# EAGLE design timer5 (EAGLE 5.07)
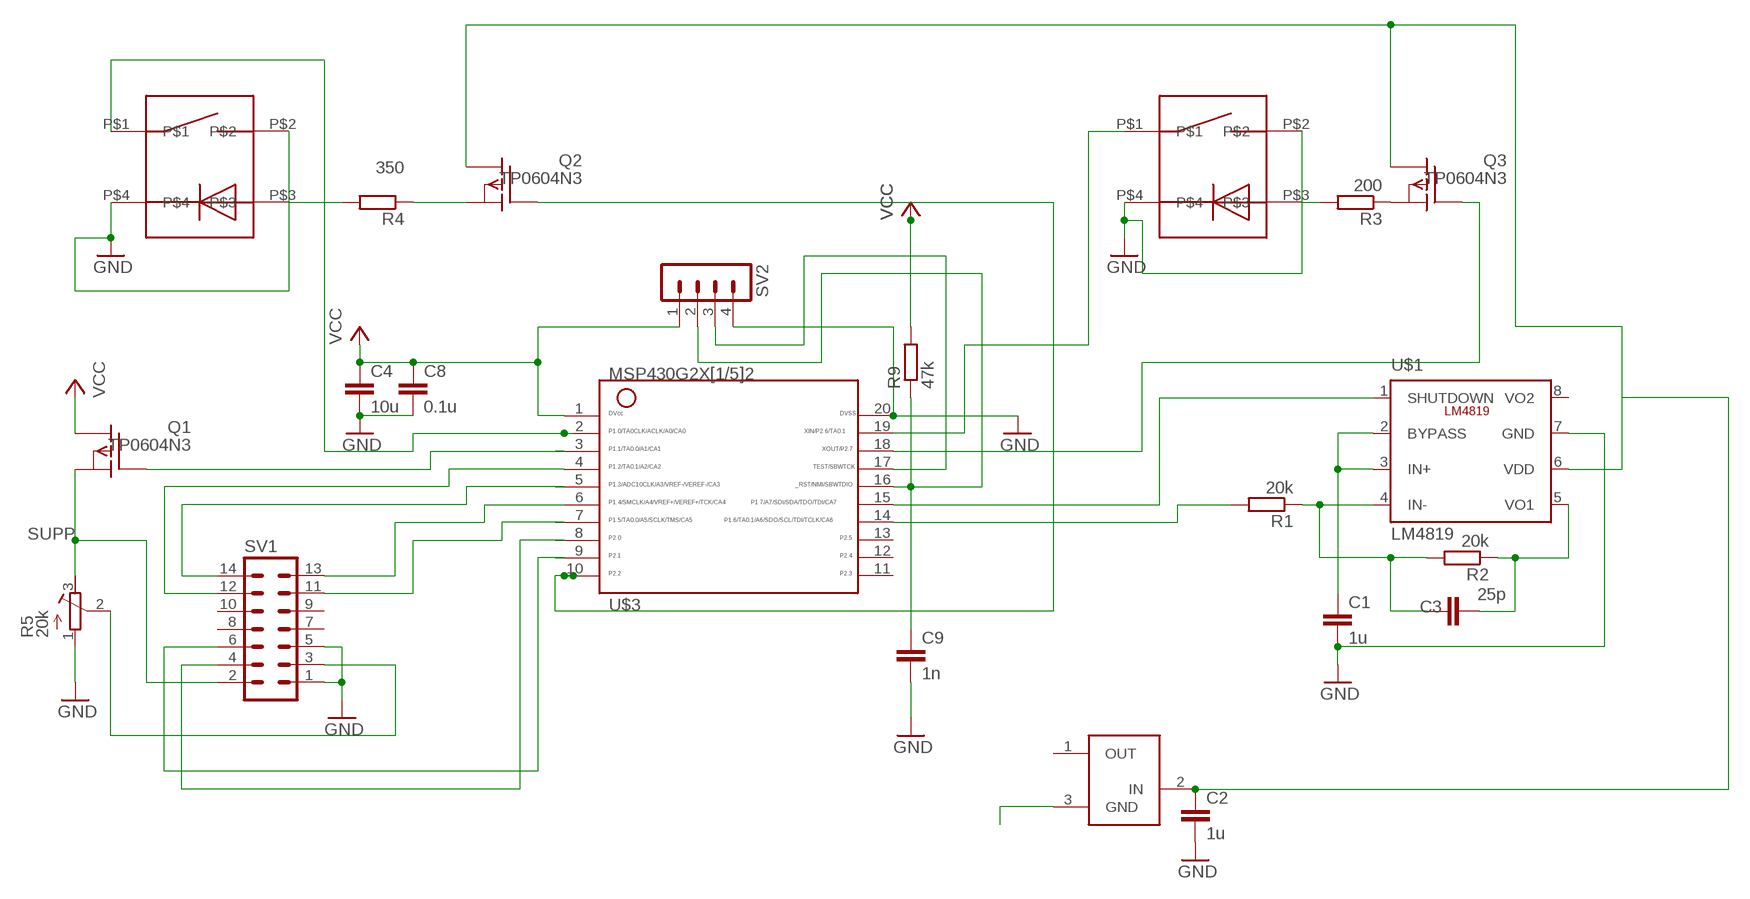
[diagram p0: schematic, sheet 1]

## Parts
C1  1u  C-EU025-025X050  [C025-025X050]
C2  1u  C-EU025-025X050  [C025-025X050]
C3  25p  C-EU075-032X103  [C075-032X103]
C4  10u  C-EUC0603  [C0603]
C8  0.1u  C-EU025-025X050  [C025-025X050]
C9  1n  C-EU150-054X183  [C150-054X183]
Q1  TP0604N3  [TO-92]
Q2  TP0604N3  [TO-92]
Q3  TP0604N3  [TO-92]
R1  20k  R-EU_0204/5  [0204/5]
R2  20k  R-EU_0204/7  [0204/7]
R3  200  R-EU_0204/5  [0204/5]
R4  350  R-EU_0204/5  [0204/5]
R5  20k  R-TRIMM3339P  [RTRIM3339P]
R9  47k  R-EU_0207/10  [0207/10]
SV1  MA07-2  [MA07-2]
SV2  MA04-1  [MA04-1]
U$1  LM4819  [SO08]
U$2  MCP1700-3002E  [TO92]
U$3  G2X[1/5]2---N20  [N20]
U$4  BOUTTONAVECLED  [BOUTTONAVECLED]
U$5  BOUTTONAVECLED  [BOUTTONAVECLED]

## Nets
GND: C1.2 C2.2 C4.2 C8.2 C9.2 R5.1(E) SV1.1 SV1.5 SV2.4 U$1.7(GND) U$3.20 U$4.P$2 U$4.P$4 U$5.P$2 U$5.P$4
N$1: Q1.2(G) U$3.3
N$2: SV2.3 U$3.17
N$3: SV1.12 U$3.4
N$4: SV1.14 U$3.5
N$5: SV1.11 U$3.7
N$6: SV1.13 U$3.6
N$9: C3.2 R2.1 U$1.5(VO1)
N$10: SV1.4 U$3.8
N$11: SV1.6 U$3.9
N$12: Q3.1(S) R3.1
N$13: C9.1 R9.1 SV2.2 U$3.16
N$14: C1.1 U$1.2(BYPASS) U$1.3(IN+)
N$15: U$1.1(SHUTDOWN) U$3.15
N$16: R1.2 U$3.14
N$17: R5.2(S) SV1.3
N$18: C3.1 R1.1 R2.2 U$1.4(IN-)
N$24: U$2.3(GND)
N$28: U$3.2 U$4.P$1
N$29: Q3.2(G) U$3.18
N$30: R4.2 U$4.P$3
N$32: Q2.1(S) R4.1
N$33: U$3.19 U$5.P$1
N$34: Q2.2(G) U$3.10
N$35: R3.2 U$5.P$3
N$36: C2.1 Q2.3(D) Q3.3(D) U$1.6(VDD) U$2.2(IN)
SUPP: Q1.1(S) R5.3(A) SV1.2
VCC: C4.1 C8.1 Q1.3(D) R9.2 SV2.1 U$3.1
Unconnected: SV1.7 SV1.8 SV1.9 SV1.10 U$1.8(VO2) U$2.1(OUT) U$3.11 U$3.12 U$3.13

## Library data of the parts
C1-C4 C8 C9 = resistor:C-EU: CAPACITOR, European symbol
Q1-Q3 = transistor-fet:TP0604N3: P-Channel Enhancement MOSFET -40V; -2A; 2,0Ohm
R1-R4 R9 = resistor:R-EU_: RESISTOR, European symbol
R5 = resistor:R-TRIMM: Trimm resistor
SV1 = con-lstb:MA07-2: PIN HEADER
SV2 = con-lstb:MA04-1: PIN HEADER
U$1 = mbonnin:LM4819: audio amplifier with shutdown
U$2 = mbonnin:MCP1700-3002E
U$3 = TI_MSP430_v16:G2X[1/5]2---N20: MSP430G2X[1/5]2 MSP430G2x52, MSP430G2x12 PDIP (N) 20 Pin Package http://focus.ti.com/docs/prod/folders/print/msp430g2452.html
U$4 U$5 = mbonnin:BOUTTONAVECLED

## Board
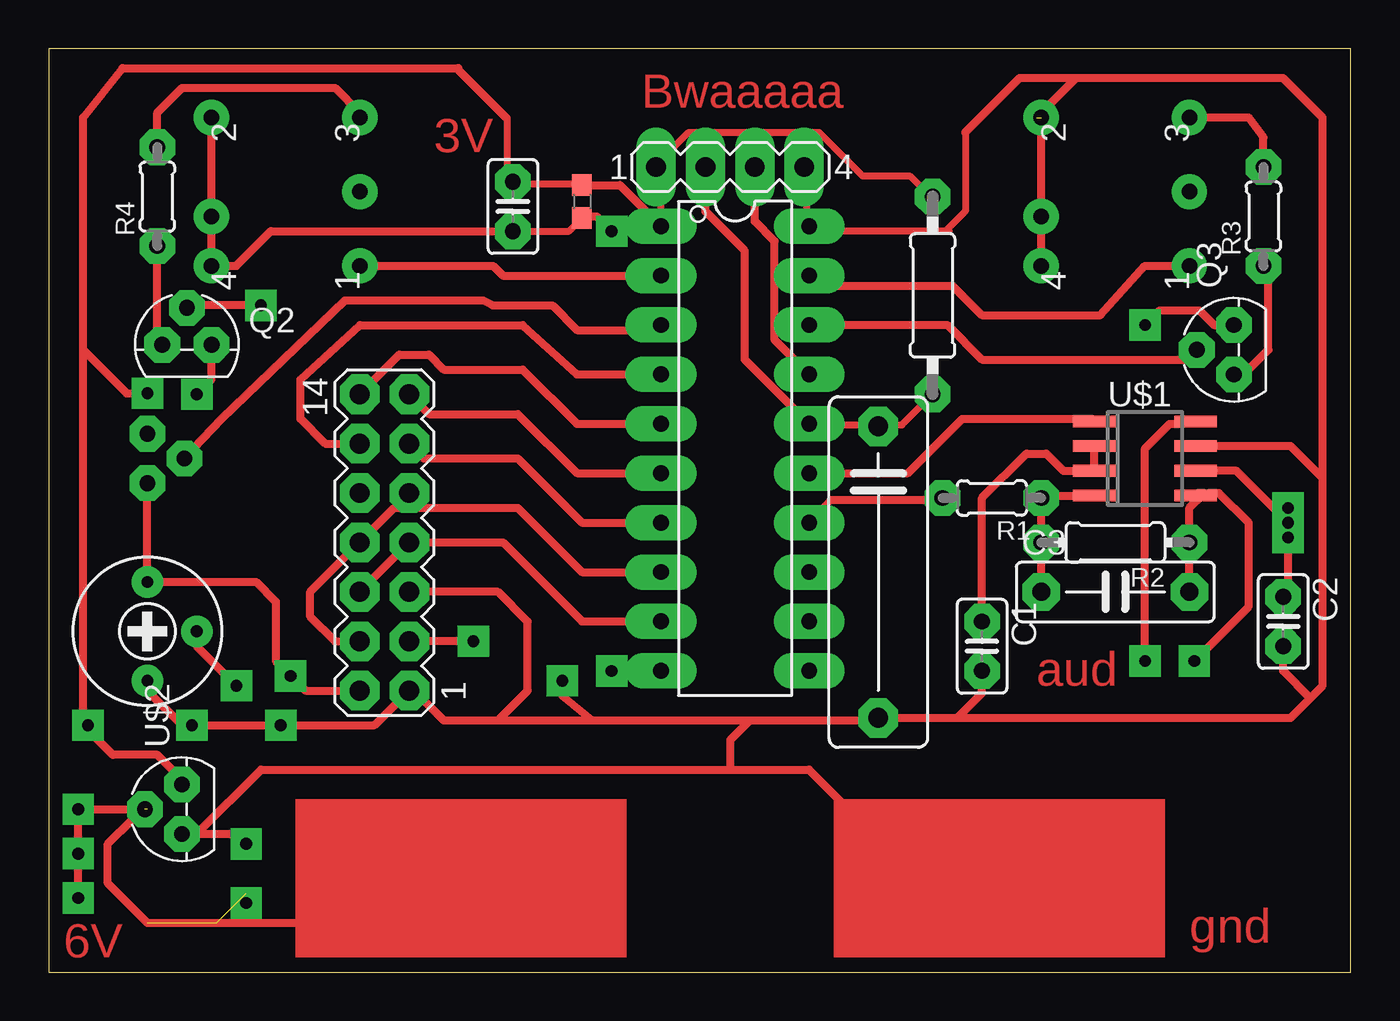
[diagram p1: board, top side]
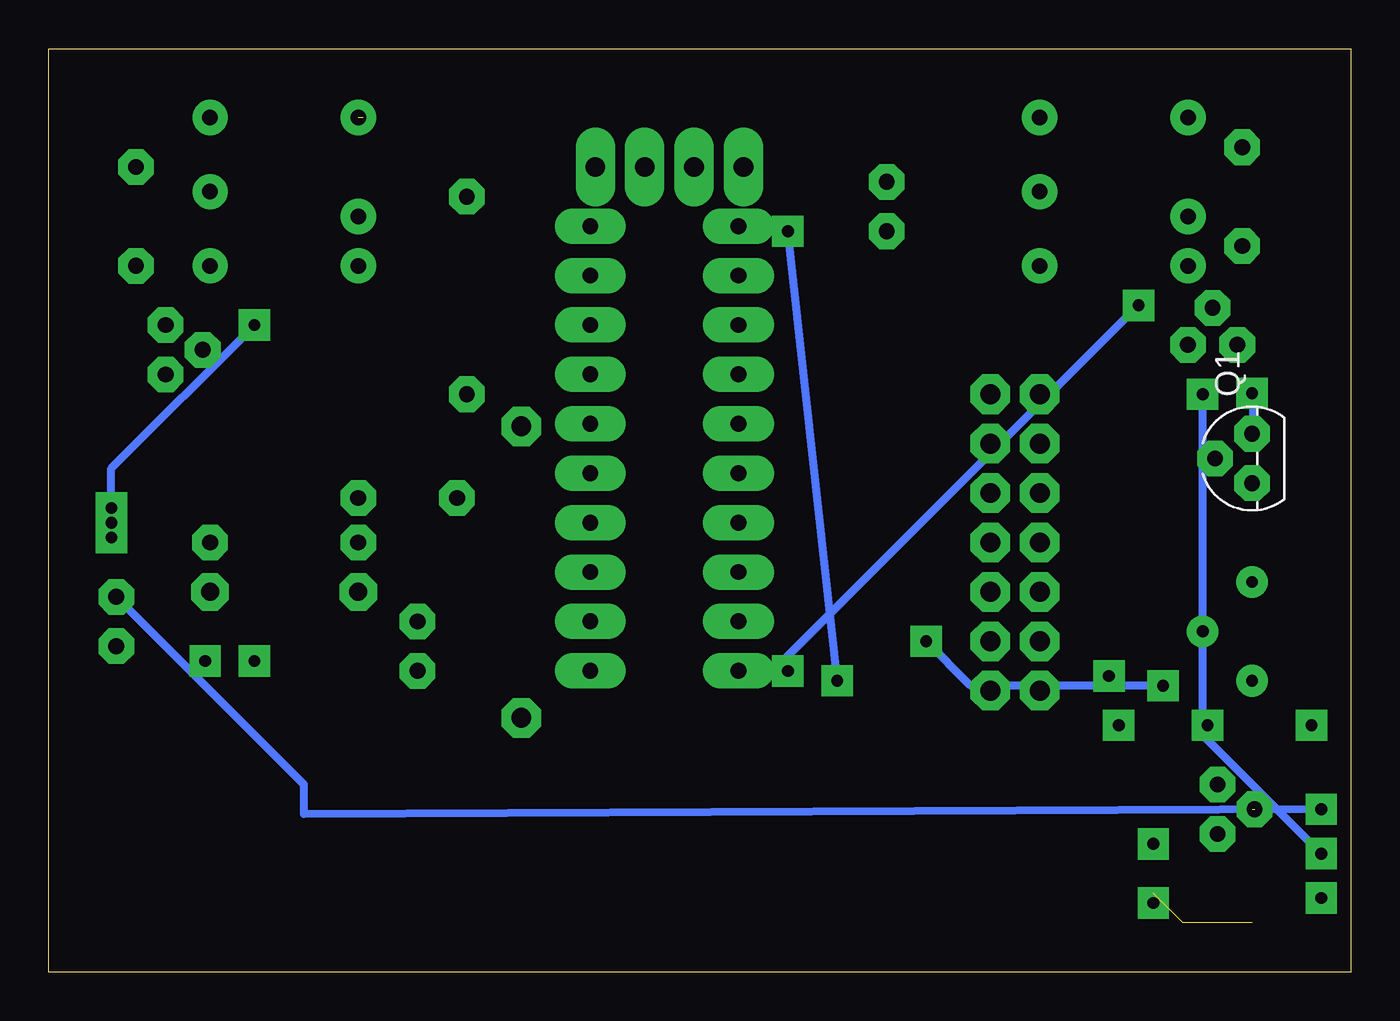
[diagram p2: board, bottom side, seen from below]

Size 66.98 x 47.49 mm. Coordinates in mm from the lower left corner, seen from the top.
Outline: 0,0 66.98,0 66.98,47.49 0,47.49 0,0
Copper layers (1*16): Top 0.035mm / dielectric 1.5mm / Bottom 0.035mm
Design rules "martin *": minimum track width 14mil, minimum drill 16mil, track to track 14mil, track to pad 20mil, pad to pad 8mil, via to via 8mil, smd to smd 8mil, copper to edge 8mil, drill to drill 8mil, minimum pad ring 20mil, minimum via ring 20mil, stop-mask expansion 4mil, vias tented up to drill 0mil, thermal gap 10mil

### Footprints (pad centres in the part's own frame; a part is rotated, then mirrored left to right if it is on the bottom)
C025-025X050 = drill 0.813 octagon: 1 -1.27,0; 2 1.27,0
C075-032X103 = drill 0.914 octagon: 1 -3.81,0; 2 3.81,0
C0603 = smd 1.1 x 1: 1 -0.85,0; 2 0.85,0
C150-054X183 = drill 1.016 octagon: 1 -7.493,0; 2 7.493,0
TO-92 = drill 0.813 octagon: 1 -1.27,0; 2 0,1.905; 3 1.27,0
0204/5 = drill 0.813 octagon: 1 -2.54,0; 2 2.54,0
0204/7 = drill 0.813 octagon: 1 -3.81,0; 2 3.81,0
RTRIM3339P = drill 0.61 round: 1 -2.54,0; 2 0,-2.54; 3 2.54,0
0207/10 = drill 0.813 octagon: 1 -5.08,0; 2 5.08,0
MA07-2 = drill 1.016 octagon: 1 -7.62,-1.27; 2 -7.62,1.27; 3 -5.08,-1.27; 4 -5.08,1.27; 5 -2.54,-1.27; 6 -2.54,1.27; 7 0,-1.27; 8 0,1.27; 9 2.54,-1.27; 10 2.54,1.27; 11 5.08,-1.27; 12 5.08,1.27; 13 7.62,-1.27; 14 7.62,1.27
MA04-1 = drill 1.016 long: 1 -3.81,0; 2 -1.27,0; 3 1.27,0; 4 3.81,0
SO08 = smd 0.6 x 2.2: 1 -1.905,-2.6; 2 -0.635,-2.6; 3 0.635,-2.6; 4 1.905,-2.6; 5 1.905,2.6; 6 0.635,2.6; 7 -0.635,2.6; 8 -1.905,2.6
TO92 = drill 0.813 octagon: 1 5.08,1.27; 2 3.81,3.175; 3 2.54,1.27
N20 = drill 0.813 long: 1 -11.435,-3.81; 2 -8.895,-3.81; 3 -6.355,-3.81; 4 -3.815,-3.81; 5 -1.275,-3.81; 6 1.265,-3.81; 7 3.805,-3.81; 8 6.345,-3.81; 9 8.885,-3.81; 10 11.425,-3.81; 11 11.425,3.81; 12 8.885,3.81; 13 6.345,3.81; 14 3.805,3.81; 15 1.265,3.81; 16 -1.275,3.81; 17 -3.815,3.81; 18 -6.355,3.81; 19 -8.895,3.81; 20 -11.435,3.81
BOUTTONAVECLED = drill 0.8 round: P$1 -3.81,-3.81; P$2 3.81,3.81; P$3 3.81,-3.81; P$4 -3.81,3.81; P$5 -1.27,3.81; P$6 0,-3.81

### Placement (x,y rotation side)
C1  48.01,16.76 270 top
C2  63.5,18.03 270 top
C3  54.86,19.56 0 top
C4  27.43,39.62 270 top
C8  23.88,39.37 270 top
C9  42.67,20.57 270 top
Q1  5.08,26.42 90 bottom
Q2  7.11,32.26 0 top
Q3  60.96,32 90 top
R1  48.51,24.38 180 top
R2  54.86,22.1 180 top
R3  62.48,38.86 90 top
R4  5.59,39.88 90 top
R5  5.08,17.53 90 top
R9  45.47,34.8 90 top
SV1  17.27,22.1 90 top
SV2  35.05,41.4 0 top
U$1  56.39,26.42 270 top
U$2  8.13,4.57 90 top
U$3  35.31,26.92 270 top
U$4  12.19,40.13 90 top
U$5  54.86,40.13 90 top

### Tracks (layer width: path | path; a pad name or v marks a point on that pad's centre or on a via)
GND  (via drill 0.6)  (1 unrouted)
  Top 0.356: SV2.4 39.01,41.35 39.01,38.51 U$3.20 39.22,38.3 39.42,38.1 46.13,38.1 46.23,38.2 | C4.2 27.38,38.71 26.77,38.1 C8.2 | 46.23,38.2 47.14,39.12 47.14,43.18 | 46.23,38.2 46.33,38.1 | C9.2 42.27,13.72
  Top 0.406: C4.2 27.6,38.77 27.69,38.86 28.19,38.86 v28.96,38.1 | R5.1 5.08,14.48 6.86,12.7 v7.37,12.7 v11.94,12.7 16.76,12.7 SV1.1 18.8,14.48 20.32,12.95 23.11,12.95 | 23.11,12.95 27.94,12.95 | 27.94,12.95 36.07,12.95 | 36.07,12.95 42.55,12.95 C9.2 46.74,13.08 | SV1.5 23.11,19.56 24.64,18.03 24.64,14.48 23.11,12.95 | 46.74,13.08 63.88,13.08 64.9,14.1 | 64.9,14.1 65.53,14.73 65.53,25.4 | 65.53,25.4 65.53,43.94 63.5,45.97 52.83,45.97 | 52.83,45.97 49.94,45.97 47.14,43.18 | v26.42,14.99 26.42,14.22 27.94,12.95 | C1.2 48.01,14.35 46.74,13.08 | U$1.7 63.88,27.05 65.53,25.4 | 35.05,10.67 35.05,11.94 36.07,12.95 | 52.83,45.97 50.8,43.94 | U$4.P$2 U$4.P$4 9.65,36.32 11.43,38.1 C8.2 | U$5.P$4 U$5.P$2 | C2.2 63.5,15.49 64.9,14.1
  Bottom 0.406: v26.42,14.99 v28.96,38.1
N$1
  Top 0.406: Q1.2 8.89,28.45 15.24,34.54 22.35,34.54 22.86,34.29 25.91,34.29 27.18,33.02 31.24,33.02 U$3.3
N$2
  Top 0.406: SV2.3 36.32,38.61 37.34,37.59 37.34,32.52 U$3.17
N$3
  Top 0.406: U$3.4 27.17,30.74 24.38,33.27 16,33.27 12.95,30.48 12.95,28.45 14.22,27.18 SV1.12
N$4
  Top 0.406: U$3.5 27.17,28.2 24.38,30.99 20.32,30.99 19.56,31.75 18.03,31.75 SV1.14
N$5
  Top 0.406: U$3.7 27.43,23.12 24.13,26.42 19.3,26.42 SV1.11
N$6
  Top 0.406: U$3.6 27.17,25.66 24.13,28.7 19.56,28.7 SV1.13
N$9
  Top 0.406: U$1.5 59.12,24.64 59.44,24.64 58.67,23.88 R2.1 C3.2
N$10
  Top 0.406: U$3.8 27.43,20.58 24.13,23.88 17.78,23.88 13.46,19.56 13.46,18.29 14.73,17.02 SV1.4
N$11
  Top 0.406: U$3.9 27.43,18.04 23.37,22.1 18.8,22.1 18.54,21.84 18.29,21.84 SV1.6
N$12
  Top 0.406: Q3.1 61.47,30.73 62.74,32 62.74,36.07 R3.1
N$13
  Top 0.356: 42.67,28.14 39.22,28.14 U$3.16 39.01,28.35 | 42.67,28.14 43.89,28.14 R9.1 | 42.67,28.14 C9.1
  Top 0.406: SV2.2 33.78,39.12 35.81,37.08 35.81,31.5 U$3.16
N$14
  Top 0.406: U$1.2 U$1.3 52.2,25.78 51.31,26.67 50.29,26.67 48.01,24.38 C1.1
N$15
  Top 0.406: U$3.15 44.2,25.66 46.99,28.45 53.66,28.45 U$1.1
N$16
  Top 0.356: 40.23,24.28 39.22,23.27 U$3.14
  Top 0.406: 40.23,24.28 45.87,24.28 R1.2
N$17  (via drill 0.6)
  Top 0.406: R5.2 7.62,16.76 v9.65,14.73 | v21.84,17.02 SV1.3
  Bottom 0.406: v9.65,14.73 19.56,14.73 v21.84,17.02
N$18
  Top 0.406: U$1.4 51.18,24.51 R1.1 R2.2 C3.1
N$20  (via drill 0.6)
  Top 0.406: 59.69,24.64 60.2,24.64 61.72,23.11 61.72,18.8 v58.93,16
N$21  (via drill 0.6)
  Top 0.406: 58.17,28.19 57.66,28.19 56.39,26.92 v56.39,16
N$24
  Top 0.406: U$2.3 9.4,7.11 10.16,6.35
N$25
  Top 0.406: 7.11,7.11 7.62,7.11 10.92,10.41 39.12,10.41 42.67,6.86 42.93,6.86 43.43,7.37
N$26  (3 unrouted)
  Top 0.406: 4.83,7.87 4.32,7.87 3.05,6.6 3.05,4.57 5.08,2.54 13.46,2.54
N$28
  Top 0.406: U$4.P$1 22.86,36.32 23.37,35.81 U$3.2
N$29
  Top 0.406: U$3.18 46.22,33.28 48.01,31.5 58.55,31.5 Q3.2
N$30
  Top 0.406: R4.2 5.59,44.2 6.86,45.47 14.73,45.47 16,44.2 U$4.P$3
N$31  (via drill 0.6)
  other vias: 63.75,23.88
N$32
  Top 0.406: R4.1 5.59,32.51 Q2.1
N$33
  Top 0.406: U$3.19 39.63,35.31 46.48,35.31 48.01,33.78 54.1,33.78 56.39,36.32 U$5.P$1
N$34  (via drill 0.6)
  Top 0.406: U$3.10 29.47,15.5 v28.96,15.49 | v10.92,34.29 7.24,34.29 Q2.2
  Bottom 0.406: v28.96,15.49 29.46,15.75 v10.92,34.29
N$35
  Top 0.406: R3.2 62.48,42.93 61.72,43.94 U$5.P$3
N$36  (via drill 0.6)  (1 unrouted)
  Top 0.406: 58.8,25.78 U$1.6 61.09,25.78 v63.75,23.11 v63.75,22.35 63.75,19.56 C2.1 64.01,19.56 64.01,19.81 | Q3.3 59.94,33.27 59.18,34.04 57.15,34.04 v56.39,33.27 | 5.08,8.38 v1.52,8.38 v1.52,6.1 v1.52,3.81 | Q2.3 8.38,30.48 v7.62,29.72
  Bottom 0.406: v1.52,8.38 53.85,8.13 53.85,9.65 C2.1 | v7.62,29.72 7.62,12.19 v1.52,6.1 | v63.75,23.11 63.75,25.91 v56.39,33.27
N$37  (via drill 0.6)
  other vias: 2.03,12.7
N$38  (via drill 0.6)
  other vias: 10.16,6.6
N$39  (via drill 0.6)
  other vias: 10.16,3.56
SUPP  (via drill 0.6)
  Top 0.406: SV1.2 13.21,14.48 v12.45,15.24 11.68,16 11.68,19.05 10.67,20.07 R5.3 Q1.1
VCC  (via drill 0.6)
  Top 0.356: U$3.1 31.5,41.35 31.29,41.35 SV2.1 31.29,41.55 32.92,43.18 39.62,43.18 41.86,40.95 44.3,40.95 45.31,39.93 R9.2 | C4.1 27.38,40.54 23.93,40.54 C8.1 | 23.57,40.28 23.72,40.54 C8.1 | 23.57,43.89 23.57,40.28 | 23.57,40.28 C8.1
  Top 0.406: v5.08,29.77 4.01,29.77 1.78,32 | 1.78,32 1.78,43.94 3.81,46.48 21.08,46.48 21.08,46.38 23.57,43.89 | 1.78,32 1.78,12.7 3.3,11.18 5.59,11.18 6.86,9.91 | C4.1 29.38,40.47 U$3.1
  Bottom 0.356: v5.08,29.77 Q1.3
(copper drawn outside any net)
  shapes: Top area x2

### Text on the board
Top: Bwaaaaa | 3V | aud | gnd | 6V